# Altium schematic sheet RF Front End.SchDoc
size B; SheetNumber: 4; SheetTotal: 6
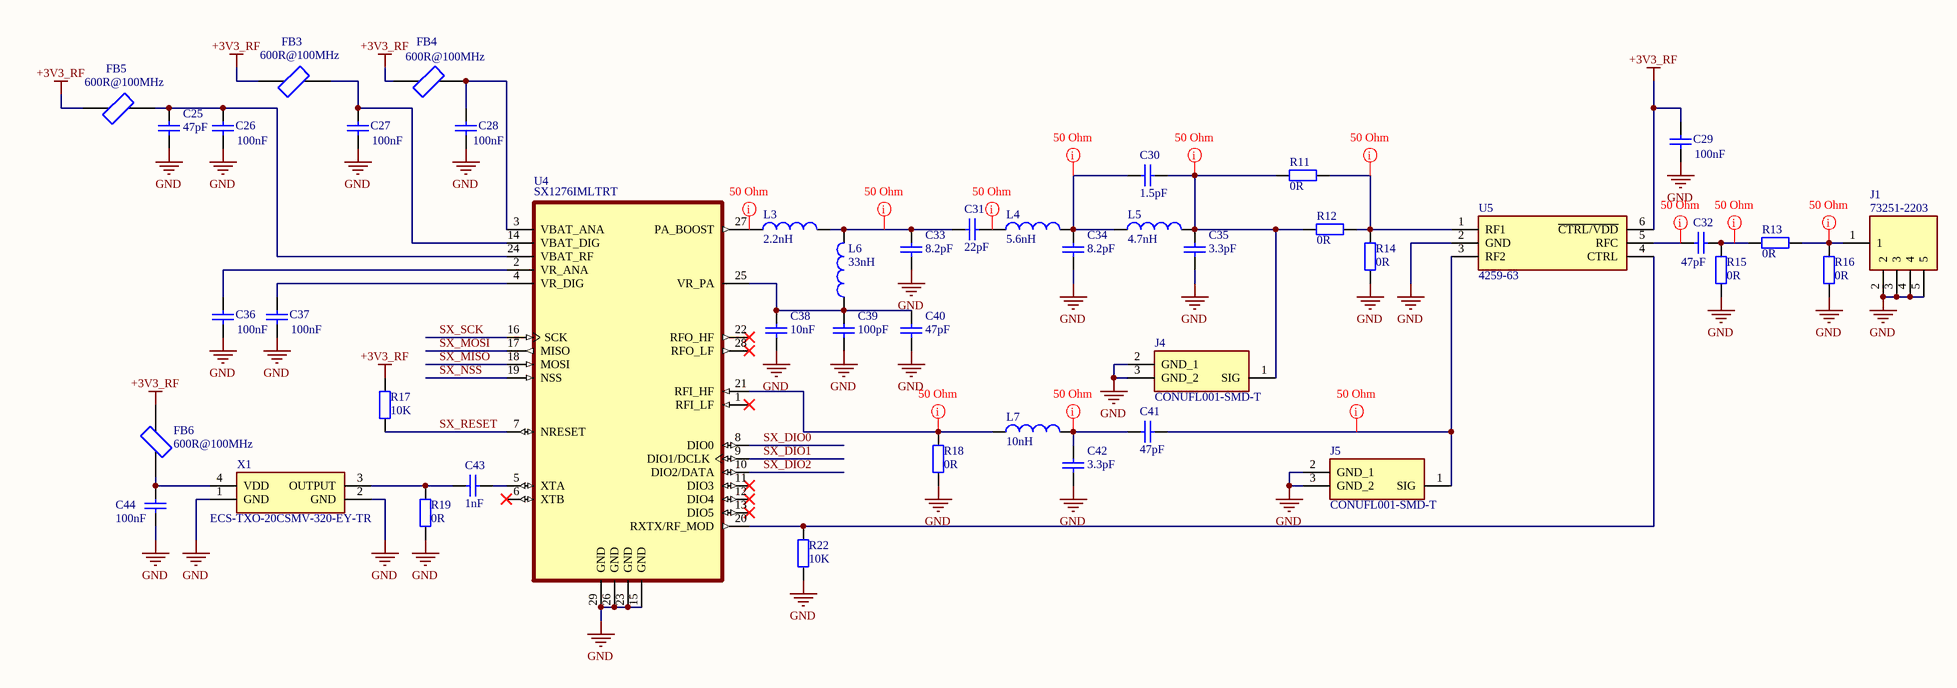
[diagram p0: RF Front End.SchDoc]

## Parts
C25  47pF  [SMD-0402C]
C26  100nF  [SMD-0402C]
C27  100nF  [SMD-0402C]
C28  100nF  [SMD-0402C]
C29  100nF  [SMD-0402C]
C30  1.5pF  [SMD-0402C]
C31  22pF  [SMD-0402C]
C32  47pF  [SMD-0402C]
C33  8.2pF  [SMD-0402C]
C34  8.2pF  [SMD-0402C]
C35  3.3pF  [SMD-0402C]
C36  100nF  [SMD-0402C]
C37  100nF  [SMD-0402C]
C38  10nF  [SMD-0402C]
C39  100pF  [SMD-0402C]
C40  47pF  [SMD-0402C]
C41  47pF  [SMD-0402C]
C42  3.3pF  [SMD-0402C]
C43  1nF  [SMD-0402C]
C44  100nF  [SMD-0402C]
FB3  600R@100MHz  [0402 Ferrite Bead]
FB4  600R@100MHz  [0402 Ferrite Bead]
FB5  600R@100MHz  [0402 Ferrite Bead]
FB6  600R@100MHz  [0402 Ferrite Bead]
J1  73251-2203  [732512203]
J4  CONUFL001-SMD-T  [CONUFL001SMDT]
J5  CONUFL001-SMD-T  [CONUFL001SMDT]
L3  2.2nH  [SMD-0402-RES]
L4  5.6nH  [SMD-0402-RES]
L5  4.7nH  [SMD-0402-RES]
L6  33nH  [SMD-0402-RES]
L7  10nH  [SMD-0402-RES]
R11  0R  [SMD-0402-RES]
R12  0R  [SMD-0402-RES]
R13  0R  [SMD-0402-RES]
R14  0R  [SMD-0402-RES]
R15  0R  [SMD-0402-RES]
R16  0R  [SMD-0402-RES]
R17  10K  [SMD-0402-RES]
R18  0R  [SMD-0402-RES]
R19  0R  [SMD-0402-RES]
R22  10K  [SMD-0402-RES]
U4  SX1276IMLTRT  [SX1276IMLTRT]
U5  4259-63  [4259-63]
X1  ECS-TXO-20CSMV-320-EY-TR  [ECS-TXO-20CSMV-320-EY-TR]

## Nets
+3V3_RF: C29.2 FB3.1 FB4.1 FB5.1 FB6.2 R17.2 U5.6(~{CTRL/}~{VDD})
GND: C25.1 C26.1 C27.1 C28.1 C29.1 C33.1 C34.1 C35.1 C36.1 C37.1 C38.1 C39.1 C40.1 C42.1 C44.1 J1.2 J1.3 J1.4 J1.5 J4.2(GND_1) J4.3(GND_2) J5.2(GND_1) J5.3(GND_2) R14.1 R15.1 R16.1 R18.1 R19.1 R22.1 U4.15(GND) U4.23(GND) U4.26(GND) U4.29(GND) U5.2(GND) X1.1(GND) X1.2(GND)
SX_DIO0: U4.8(DIO0)
SX_DIO1: U4.9(DIO1/DCLK)
SX_DIO2: U4.10(DIO2/DATA)
SX_MISO: U4.18(MOSI)
SX_MOSI: U4.17(MISO)
SX_NSS: U4.19(NSS)
SX_RESET: R17.1 U4.7(NRESET)
SX_SCK: U4.16(SCK)
NetC25_2: C25.2 C26.2 FB5.2 U4.24(VBAT_RF)
NetC27_2: C27.2 FB3.2 U4.14(VBAT_DIG)
NetC28_2: C28.2 FB4.2 U4.3(VBAT_ANA)
NetC30_1: C30.1 C35.2 J4.1(SIG) L5.2 R11.2 R12.2
NetC30_2: C30.2 C34.2 L4.2 L5.1
NetC31_1: C31.1 L4.1
NetC31_2: C31.2 C33.2 L3.2 L6.2
NetC32_1: C32.1 R13.2 R15.2
NetC32_2: C32.2 U5.5(RFC)
NetC36_2: C36.2 U4.2(VR_ANA)
NetC37_2: C37.2 U4.4(VR_DIG)
NetC38_2: C38.2 C39.2 C40.2 L6.1 U4.25(VR_PA)
NetC41_1: C41.1 J5.1(SIG) U5.3(RF2)
NetC41_2: C41.2 C42.2 L7.2
NetC43_1: C43.1 U4.5(XTA)
NetC43_2: C43.2 R19.2 X1.3(OUTPUT)
NetC44_2: C44.2 FB6.1 X1.4(VDD)
NetJ1_1: J1.1 R13.1 R16.2
NetL3_1: L3.1 U4.27(PA_BOOST)
NetL7_1: L7.1 R18.2 U4.21(RFI_HF)
NetR11_1: R11.1 R12.1 R14.2 U5.1(RF1)
NetR22_2: R22.2 U4.20(RXTX/RF_MOD) U5.4(CTRL)

Not connected (* = marked no-connect by the designer): U4 1(RFI_LF)* 6(XTB)* 11(DIO3)* 12(DIO4)* 13(DIO5)* 22(RFO_HF)* 28(RFO_LF)*

## Layout directives
net class 50 Ohm LoRa: NetC30_1, NetC30_2, NetC31_1, NetC31_2, NetC32_1, NetC32_2, NetC41_1, NetC41_2, NetJ1_1, NetL3_1, NetL7_1, NetR11_1

## Library data of the parts
C25-C44 = Cap: Capacitor; Published: 8-Jun-2000; LatestRevisionDate: 17-Jul-2002; LatestRevisionNote: Re-released for DXP Platform.; PackageReference: RAD-0.3; Publisher: Altium Limited; PackageDescription: Radial Cap, Thru-Hole; 2 Leads; 0.3 in Pin Spacing; Supplier 1: Mouser
  C25 C40: Value: 47pF; Supplier Part Number 1: 81-GRM1555C1H470JA1D
  C26-C29 C36 C37 C44: Value: 100nF; Supplier Part Number 1: 603-CC402KRX7R7BB104
  C30: Value: 1.5pF; Supplier Part Number 1: 81-GJM1555C1H1R5BB1D
  C31: Value: 22pF; Supplier Part Number 1: 81-GJM1555C1H220FB1J
  C32 C41: Value: 47pF; Supplier Part Number 1: 81-GJM1555C1H470FB1D
  C33 C34: Value: 8.2pF; Supplier Part Number 1: 81-GJM1555C1H8R2CB01
  C35 C42: Value: 3.3pF; Supplier Part Number 1: 81-GJM1555C1H3R3CB1D
  C38: Value: 10nF; Supplier Part Number 1: 791-MT15B103K500CT
  C39: Value: 100pF; Supplier Part Number 1: 187-CL05C101JB5NNNC
  C43: Value: 1nF; Supplier Part Number 1: 81-GRM36X102K50
FB3-FB6 = Ferrite: Ferrite Beads FERRITE BEAD 600 OHM 0402 1LN; MF: Laird-Signal Integrity Products; MP: MI0805K400R-10; SnapEDA_Link: https://www.snapeda.com/parts/MI0805K400R-10/Laird-Signal+Integrity+Products/view-part/?ref=snap; Package: 0805 Laird; Value: *; Check_prices: https://www.snapeda.com/parts/MI0805K400R-10/Laird-Signal+Integrity+Products/view-part/?ref=eda; Supplier 1: Mouser; Supplier Part Number 1: 81-BLM15AX601SN1D
J1 = 73251-2203: RF Connectors / Coaxial Connectors Conn 50 Ohms, SMA Jack, Right-Angle PCB, Gold; Manufacturer_Name: Molex; Geometry.Height: 10.59mm; Mouser Part Number: 538-73251-2203; Mouser Price/Stock: https://www.mouser.co.uk/ProductDetail/Molex/73251-2203?qs=KpdAywxU013Bis55GeNoeg%3D%3D; Manufacturer_Part_Number: 73251-2203; Datasheet Link: https://www.molex.com/en-us/products/part-detail-pdf/732512203?display=pdf; Supplier 1: Mouser; Supplier Part Number 1: 538-73251-2203
J4 J5 = CONUFL001-SMD-T: Connector; Manufacturer_Name: TE Connectivity; Datasheet Link: https://eu.mouser.com/datasheet/2/418/9/ENG_DS_CONUFL001_SMD_T_B-3238717.pdf; Height: 1.3mm; Manufacturer_Part_Number: CONUFL001-SMD-T; Mouser Part Number: N/A; Mouser Price/Stock: https://www.mouser.co.uk/ProductDetail/TE-Connectivity/CONUFL001-SMD-T?qs=3Rah4i%252BhyCHmRzMH%252BkLkPQ%3D%3D; Arrow Part Number: CONUFL001-SMD-T; Arrow Price/Stock: https://www.arrow.com/en/products/conufl001-smd-t/te-connectivity?utm_currency=USD&region=europe; Supplier 1: Mouser; Supplier Part Number 1: 712-CONUFL001-SMD-T
L3-L7 = Inductor: Code_IEC: 1005; Published: 8-Jun-2000; LatestRevisionDate: 29-May-2009; LatestRevisionNote: IPC-7351 Footprint Added.; PackageReference: 0402-A; Publisher: Altium Limited; PackageDescription: Chip Inductor; Code_JEITA: 0402; Supplier 1: Mouser
  L3: Value: 2.2nH; Supplier Part Number 1: 81-LQW15AN2N2C10D
  L4: Value: 5.6nH; Supplier Part Number 1: 81-LQW15AN5N6C10D
  L5: Value: 4.7nH; Supplier Part Number 1: 81-LQW15AN4N7B00D
  L6: Value: 33nH; Supplier Part Number 1: 81-LQW15AN33NJ00D
  L7: Value: 10nH; Supplier Part Number 1: 81-LQW15AN10NH00D
R11-R19 R22 = Res2: Resistor; Published: 8-Jun-2000; LatestRevisionDate: 17-Jul-2002; LatestRevisionNote: Re-released for DXP Platform.; PackageReference: AXIAL-0.4; Publisher: Altium Limited; PackageDescription: Axial Device, Thru-Hole; 2 Leads; 0.4 in Pin Spacing; Supplier 1: Mouser
  R11-R16 R18 R19: Value: 0R; Supplier Part Number 1: 603-RC0402FR-070RL
  R17 R22: Value: 10K; Supplier Part Number 1: 603-RC0402FR-7D10KL
U4 = SX1276IMLTRT: IC RF TxRx Only 802.15.4 LoRaâ„¢ 137MHz ~ 1.02GHz 28-VQFN Exposed Pad; MF: Semtech Corporation; SnapEDA_Link: https://www.snapeda.com/parts/SX1276IMLTRT/Semtech+Corporation/view-part/?ref=snap; Package: VQFN-28 Semtech; Value: *; MP: SX1276IMLTRT; Check_prices: https://www.snapeda.com/parts/SX1276IMLTRT/Semtech+Corporation/view-part/?ref=eda; Supplier 1: Mouser; Supplier Part Number 1: 947-SX1276IMLTRT
U5 = 4259-63: RF switch IC; Manufacturer_Name: Peregrine Semiconductor; Geometry.Height: 1.1mm; Mouser Part Number: 81-4259-63; Mouser Price/Stock: https://www.mouser.co.uk/ProductDetail/pSemi/4259-63?qs=iw0hurA%2FaD37qvQcKdATTw%3D%3D; Manufacturer_Part_Number: 4259-63; Datasheet Link: http://www.psemi.com/pdf/datasheets/pe4259ds.pdf; Supplier 1: Mouser; Supplier Part Number 1: 81-4259-63
X1 = ECS-TXO-20CSMV-320-EY-TR: TCXO Oscillators MultiVolt TCXO,32MHz,+/-2.5ppm,1.7V 3.465V,2.5 mA,-30 C 85 C, 2.00mm x 1.60mm; Manufacturer_Name: ECS; Geometry.Height: 0.8mm; Mouser Part Number: 520-TXO20CSMV320EYTR; Mouser Price/Stock: https://www.mouser.co.uk/ProductDetail/ECS/ECS-TXO-20CSMV-320-EY-TR?qs=7MVldsJ5UazLDC0xk68SAQ%3D%3D; Manufacturer_Part_Number: ECS-TXO-20CSMV-320-EY-TR; Datasheet Link: https://ecsxtal.com/store/pdf/ECS-TXO-20CSMV.pdf; Supplier 1: Mouser; Supplier Part Number 1: 520-TXO20CSMV320EYTR